# EAGLE design network_board_header (EAGLE 6.5.0)
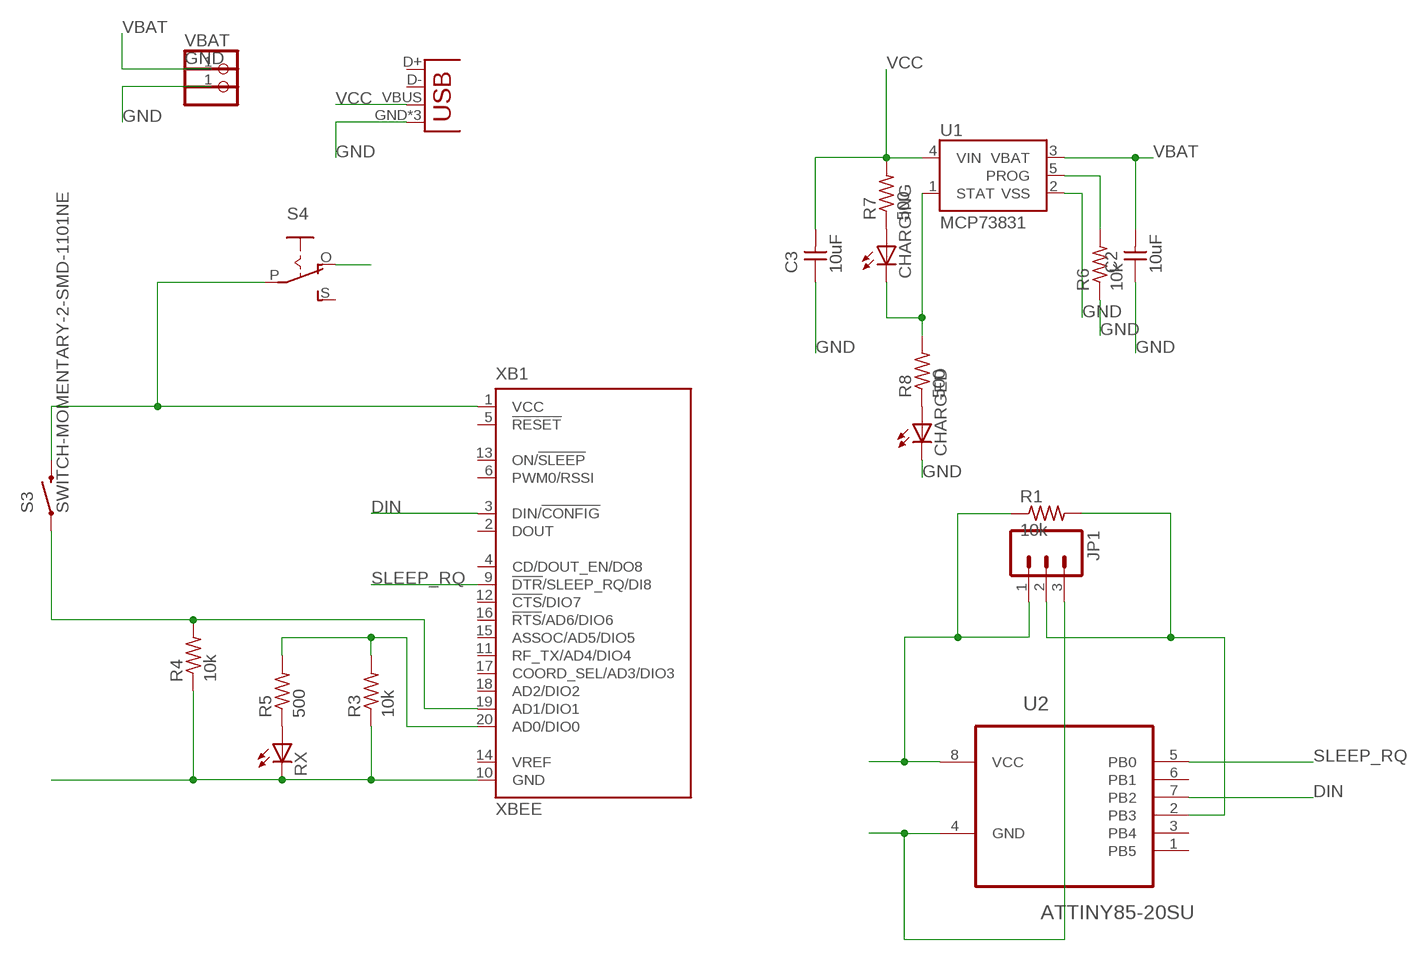
[diagram p0: schematic, sheet 1]

## Parts
C2  10uF  UNPOLARIZED_CAPACITOR1206  [1206]
C3  10uF  UNPOLARIZED_CAPACITOR1206  [1206]
CHARGED  LED1206  [1206]
CHARGING  LED1206  [1206]
GND  PINHD-1X1CB  [1X01-CLEANBIG]
JP1  M03PTH  [1X03]
R1  10k  RESISTOR1206  [1206]
R3  10k  RES-US1206  [R1206]
R4  10k  RES-US1206  [R1206]
R5  500  RES-US1206  [R1206]
R6  10k  RES-US1206  [R1206]
R7  500  RES-US1206  [R1206]
R8  500  RES-US1206  [R1206]
RX  LED1206  [1206]
S3  SWITCH-MOMENTARY-2-SMD-1101NE  [TACTILE-SWITCH-1101NE]
S4  EG1218S  [EG1218]
U1  MCP73831  [SOT23-5]
U2  ATTINY85-20SU  [SOIC127P798X216-8N]
VBAT  PINHD-1X1CB  [1X01-CLEANBIG]
X1  USB-MICROB  [USB-MICROB]
XB1  XBEE  [XBEE]

## Nets
DIN: U2.7(PB2) XB1.3(DIN/!CONFIG)
GND: C2.1 C3.1 CHARGED.2(C) GND.1 JP1.3 R3.1 R4.1 R6.1 RX.2(C) U1.2(VSS) U2.4(GND) X1.GND X1.MT1(GND) X1.MT2(GND) XB1.10(GND)
N$1: R4.2 S3.P$1 XB1.19(AD1/DIO1)
N$2: R5.1 RX.1(A)
N$5: R3.2 R5.2 XB1.20(AD0/DIO0)
N$7: R6.2 U1.5(PROG)
N$9: CHARGING.1(A) R7.1
N$10: CHARGED.1(A) R8.1
N$11: CHARGING.2(C) R8.2 U1.1(STAT)
N$23: JP1.2 R1.2 U2.2(PB3)
SLEEP_RQ: U2.5(PB0) XB1.9(!DTR!/SLEEP_RQ/DI8)
VBAT: C2.2 S4.O U1.3(VBAT) VBAT.1
VCC: C3.2 R7.2 U1.4(VIN) X1.VBUS
VIN: JP1.1 R1.1 S3.P$2 S4.P U2.8(VCC) XB1.1(VCC)
Unconnected: S4.S U2.1(PB5) U2.3(PB4) U2.6(PB1) X1.D+ X1.D- XB1.2(DOUT) XB1.4(CD/DOUT_EN/DO8) XB1.5(!RESET) XB1.6(PWM0/RSSI) XB1.11(RF_TX/AD4/DIO4) XB1.12(!CTS!/DIO7) XB1.13(ON/!SLEEP) XB1.14(VREF) XB1.15(ASSOC/AD5/DIO5) XB1.16(!RTS!/AD6/DIO6) XB1.17(COORD_SEL/AD3/DIO3) XB1.18(AD2/DIO2)

## Library data of the parts
C2 C3 = ng:UNPOLARIZED_CAPACITOR: unpolarized_capacitor
CHARGED CHARGING RX = ng:LED
GND VBAT = adafruit:PINHD-1X1: Pin header 1x1 for 0.1" spacing With round pins
JP1 = SparkFun-Connectors:M03: Header 3 Standard 3-pin 0.1" header. Use with straight break away headers (SKU : PRT-00116), right angle break away headers (PRT-00553), swiss pins (PRT-00743), machine pins (PRT-00117), and female headers (PRT-00115). Molex polarized connector foot print use with SKU : PRT-08232 with associated crimp pins and housings.
R1 = ng:RESISTOR
R3-R8 = fab:RES-US: Resistor (US Symbol) Variants with postfix FAB are widened to allow the routing of internal traces
S3 = SparkFun-Electromechanical:SWITCH-MOMENTARY-2: Various NO switches- pushbuttons, reed, etc
S4 = adafruit:EG1218: SLIDING SWITCH 0.1" spacing through hole, vertical SPDT slide switch http://www.ladyada.net/library/pcb/eaglelibrary.html
U1 = SparkFun-PowerIC:MCP73831: Miniature single cell, fully integrated Li-Ion, Li-polymer charge management controller http://ww1.microchip.com/downloads/en/DeviceDoc/21984a.pdf IC-09995; PROD_ID: IC-09995
U2 = Atmel_By_element14_Batch_1:ATTINY85-20SU: 8-bit Microcontroller with In-System Programmable Flash; MPN: ATTINY85-20SU; OC_FARNELL: 1455164; OC_NEWARK: 58M3797; PACKAGE: SOIC-8; SUPPLIER: Atmel
X1 = SparkFun-Connectors:USB: USB Connectors USB-B-PTH is fully proven SKU : PRT-00139 USB-miniB is fully proven SKU : PRT-00587 USB-A-PCB is untested. USB-A-H is throughly reviewed, but untested. Spark Fun Electronics SKU : PRT-00437 USB-B-SMT is throughly reviewed, but untested. Needs silkscreen touching up. USB-A-S has not been used/tested USB-MB-H has not been used/tested
XB1 = maxstream:XBEE: XBee (TM) /XBee-PRO(TM) OEM RF Modules Source: MaxStream, Inc. xbee_productmanual.pdf; MPN: XBP24-Z7UIT-004; OC_FARNELL: 1751799; OC_NEWARK: 34R5507

## Board
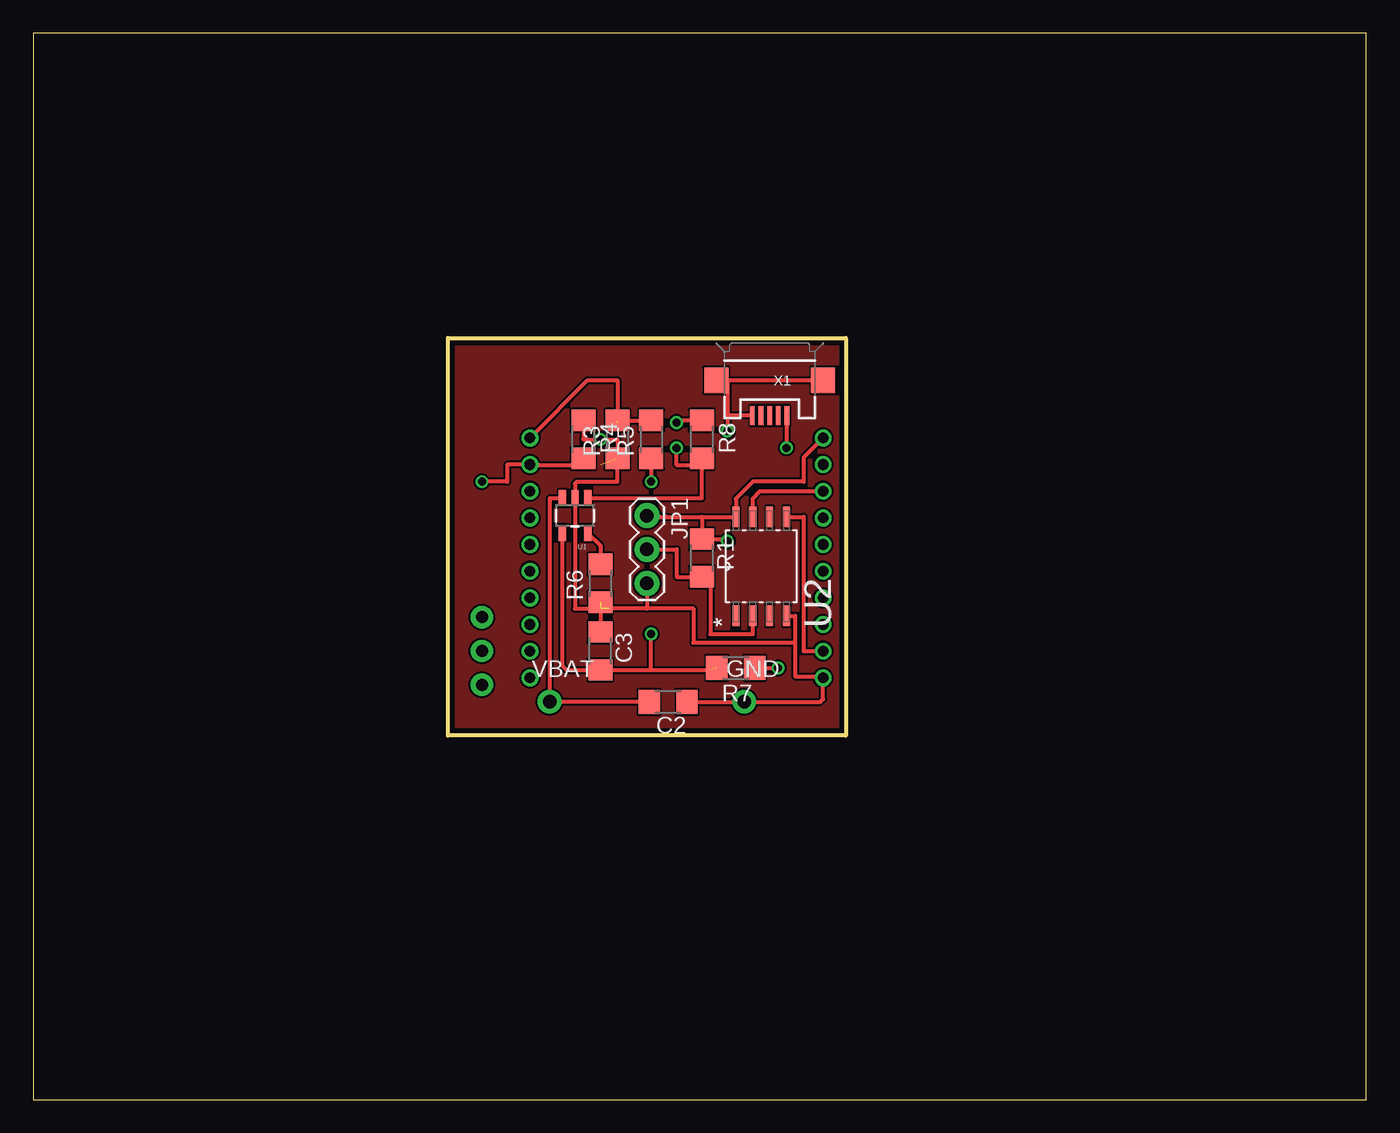
[diagram p1: board, top side]
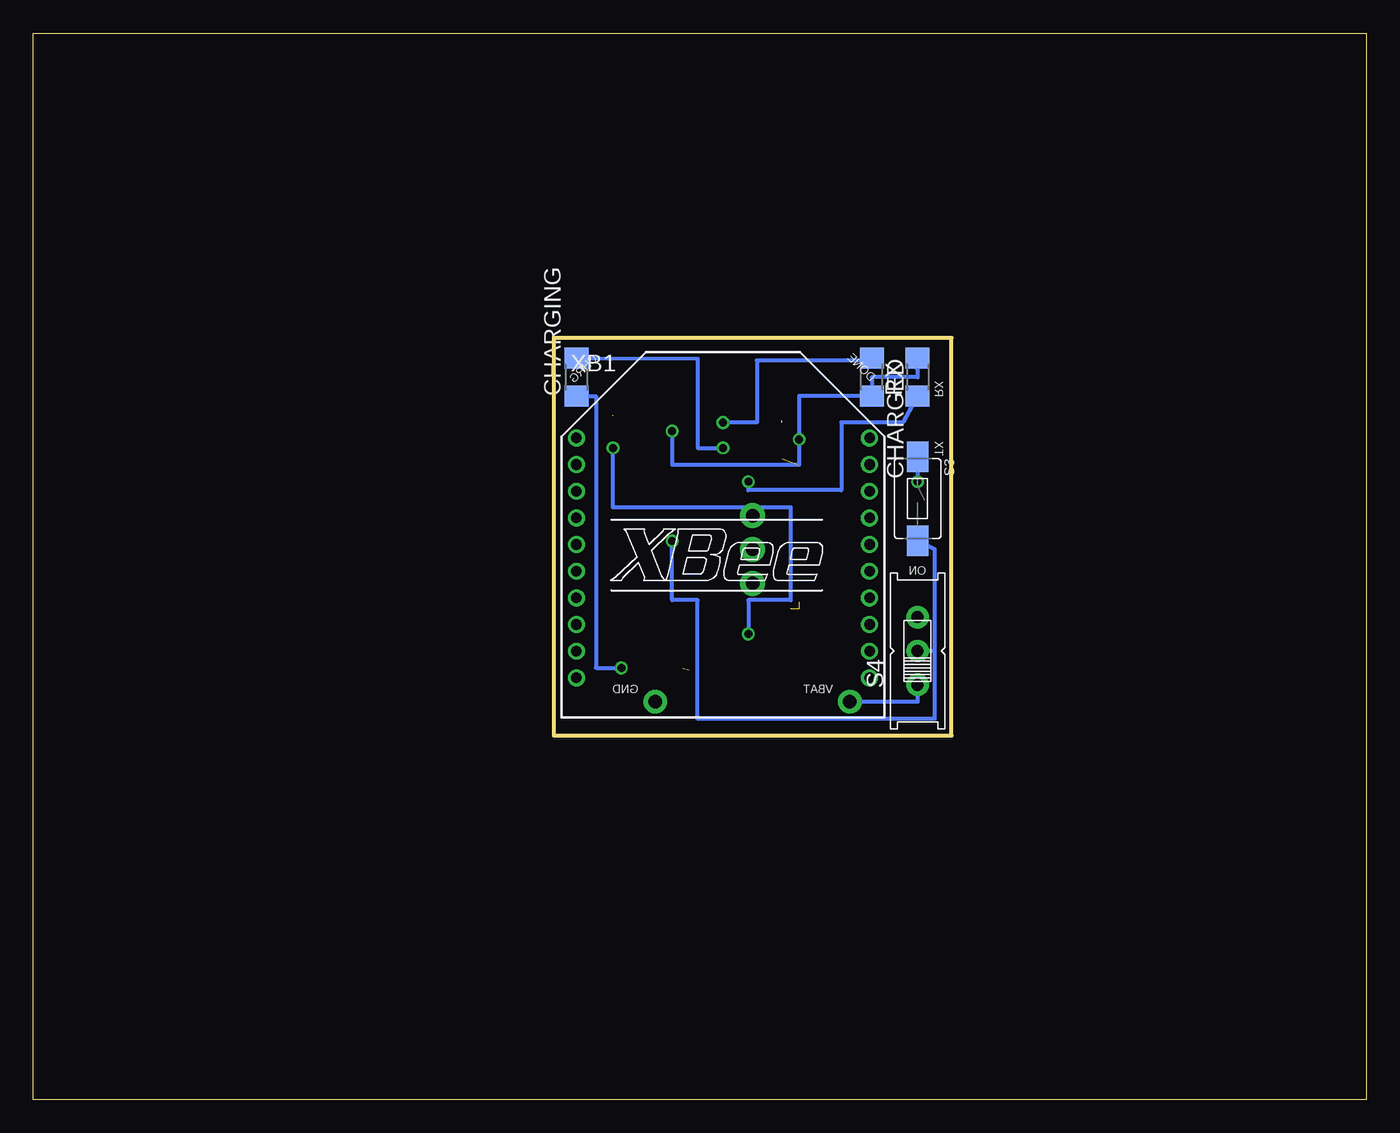
[diagram p2: board, bottom side, seen from below]

Size 100 x 80 mm. Coordinates in mm from the lower left corner, seen from the top.
Outline: 0,0 100,0 100,80 0,80 0,0
Outline: 31.11,27.3 31.11,57.15 60.96,57.15 60.96,27.3 31.11,27.3
Copper layers (1*16): Top 0.0356mm / dielectric 1.5011mm / Bottom 0.0356mm
Design rules "LaenPCBOrder": minimum track width 6mil, minimum drill 13mil, track to track 6mil, track to pad 6mil, pad to pad 6mil, via to via 6mil, smd to smd 6mil, copper to edge 15mil, drill to drill 6mil, minimum pad ring 7mil, minimum via ring 7mil, stop-mask expansion 3mil, vias tented up to drill 0mil, thermal gap 10mil

### Footprints (pad centres in the part's own frame; a part is rotated, then mirrored left to right if it is on the bottom)
1206 = smd 1.6 x 1.803: 1 -1.422,0; 2 1.422,0
1X01-CLEANBIG = drill 1.016 pad 1.778: 1 0,0
1X03 = drill 1.016 pad 1.88: 1 0,0; 2 2.54,0; 3 5.08,0
R1206 = smd 1.6 x 1.803: 1 -1.422,0; 2 1.422,0
TACTILE-SWITCH-1101NE = smd 2.3 x 1.6: P$1 -3.15,0; P$2 3.15,0
EG1218 = drill 0.9 pad 1.676: O -2.54,0; P 0,0; S 2.54,0
SOT23-5 = smd 0.55 x 1.2: 1 -0.95,-1.3; 2 0,-1.3; 3 0.95,-1.3; 4 0.95,1.3; 5 -0.95,1.3
SOIC127P798X216-8N = smd 1.549 x 0.533: 1 -3.708,1.905; 2 -3.708,0.635; 3 -3.708,-0.635; 4 -3.708,-1.905; 5 3.708,-1.905; 6 3.708,-0.635; 7 3.708,0.635; 8 3.708,1.905
USB-MICROB = smd 0.35 x 1.4: D+ 0,2.65; D- -0.65,2.65; GND 1.3,2.65; ID 0.65,2.65; VBUS -1.3,2.65 | smd 1.8 x 1.9: MT1 -4,0; MT2 4,0
XBEE = drill 0.8 pad 1.27: 1 -11,9; 2 -11,7; 3 -11,5; 4 -11,3; 5 -11,1; 6 -11,-1; 7 -11,-3; 8 -11,-5; 9 -11,-7; 10 -11,-9; 11 11,-9; 12 11,-7; 13 11,-5; 14 11,-3; 15 11,-1; 16 11,1; 17 11,3; 18 11,5; 19 11,7; 20 11,9

### Placement (x,y rotation side)
C2  47.62,29.84 180 top
C3  42.55,33.66 270 top
CHARGED  37.09,54.2 270 bottom
CHARGING  59.26,54.2 90 bottom
GND  53.34,29.84 0 top
JP1  46.04,43.81 270 top
R1  50.16,40.64 270 top
R3  43.81,49.53 90 top
R4  41.27,49.53 270 top
R5  46.35,49.53 90 top
R6  42.55,38.73 90 top
R7  52.7,32.38 180 top
R8  50.16,49.53 270 top
RX  33.66,54.2 90 bottom
S3  33.66,45.09 270 bottom
S4  33.66,33.66 90 bottom
U1  40.64,43.81 180 top
U2  54.61,40.01 90 top
VBAT  38.73,29.84 0 top
X1  55.24,53.98 180 top
XB1  48.26,40.64 0 bottom

### Tracks (layer width: path | path; a pad name or v marks a point on that pad's centre or on a via)
DIN
  Top 0.305: 59.26,45.72 XB1.3 54.53,45.64 53.98,45.09 U2.7
GND  (via drill 0.6)  (3 unrouted)
  Top 0.305: U2.4 57.15,36.3 57.15,34.29 | 57.15,34.29 57.15,31.75 59.26,31.75 XB1.10 59.26,30.05 59.05,29.84 GND.1 C2.1 | 57.15,34.29 49.53,34.29 49.53,36.83 46.04,36.83 | C3.1 42.55,36.83 40.64,36.83 U1.2 40.64,46.2 40.79,46.35 43.81,46.35 R3.1 43.81,49.53 v42.55,49.53 41.27,49.53 R4.1 | 46.04,36.83 43.18,36.83 | X1.GND 52.07,51.33 | 52.07,51.33 v52.07,50.16 | X1.MT1 X1.MT2 52.07,53.98 52.07,51.33 | JP1.3 46.04,36.83
  Bottom 0.305: 33.69,54.8 RX.2 33.66,54.2 37.09,54.2 37.09,52.81 | 37.09,52.81 42.55,52.81 v42.55,49.53 42.55,47.62 52.07,47.62 v52.07,50.16 | 37.09,52.81 CHARGED.2
N$1  (via drill 0.6)
  Top 0.305: R4.2 41.27,47.62 37.91,47.62 XB1.19 35.56,47.64 35.56,46.35 v33.66,46.35
  Bottom 0.305: S3.P$1 v33.66,46.35
N$2  (via drill 0.6)
  Top 0.305: R5.1 46.84,47.62 46.84,48.26 46.35,48.26 v46.35,46.35
  Bottom 0.305: RX.1 34.77,50.8 39.37,50.8 39.37,45.72 46.35,45.72 v46.35,46.35
N$5  (1 unrouted)
  Top 0.305: R3.2 R5.2 | XB1.20 41.59,53.98 43.81,53.98 43.81,50.8
N$7
  Top 0.305: U1.5 42.55,41.56 R6.2
N$9  (via drill 0.6)
  Top 0.305: R7.1 v55.88,32.38
  Bottom 0.305: CHARGING.1 57.78,52.78 57.78,32.38 v55.88,32.38
N$10  (via drill 0.6)
  Top 0.305: R8.1 48.26,50.95 v48.26,50.8
  Bottom 0.305: v48.26,50.8 45.72,50.8 45.72,55.47 37.09,55.47 CHARGED.1
N$11  (via drill 0.6)
  Top 0.305: U1.1 50.16,45.12 R8.2 50.16,47.62 48.26,47.62 v48.26,48.9
  Bottom 0.305: CHARGING.2 50.16,55.58 50.16,48.9 v48.26,48.9
N$12
  pour Top: 31.11,27.3 31.11,57.15 60.96,57.15 60.96,27.3
N$23
  Top 0.305: U2.2 53.98,34.92 50.8,34.92 50.8,39.22 R1.2 48.26,39.22 48.26,41.27 JP1.2
SLEEP_RQ
  Top 0.305: U2.5 57.78,43.71 57.78,33.66 59.26,33.66 XB1.9
VBAT
  Top 0.305: C2.2 VBAT.1 38.73,45.12 U1.3
  Bottom 0.305: S4.O 33.66,29.84 VBAT.1
VCC  (via drill 0.6)  (2 unrouted)
  Top 0.305: U1.4 39.69,32.55 40.01,32.23 C3.2 46.35,32.23 | 46.35,32.23 50.8,32.23 50.8,31.75 | 46.35,32.23 v46.35,34.92 | 56.52,51.33 v56.52,48.9
  Bottom 0.305: v56.52,48.9 56.52,44.45 43.18,44.45 43.18,37.47 46.35,37.47 v46.35,34.92
VIN  (via drill 0.6)
  Top 0.305: 50.16,43.71 R1.1 52.07,42.06 v52.07,41.91 | 50.16,43.71 47.52,43.71 46.99,43.71 46.04,43.71 JP1.1 | XB1.1 57.78,48.16 57.78,46.35 53.98,46.35 52.7,45.09 U2.8 50.16,43.71
  Bottom 0.305: 32.38,33.66 32.38,28.57 50.16,28.57 50.16,37.47 52.07,37.47 v52.07,41.91 | S3.P$2 32.38,41.3 32.38,33.66 | 32.38,33.66 S4.P

### Text on the board
bPlace: CHRG | DONE | RX | TX | ON | VBAT | GND